# Altium schematic sheet Sunfish_ECU_MotorFilter_RevA.SchDoc
size A3; _PRJ_TITLE: PROJECT TITLE; _SHT_TITLE: Sheet; _REV: A; PageSetup: Record=PageOptions|CenterHorizontal=True|CenterVertical=True|PrintScale=0.71|XCorrection=1.00|YCorrection=1.00|PrintKind=0|BorderSize=5000000|LeftOffset=0|BottomOffset=0|Orientation=2|PaperLength=1000|PaperWidth=1000|Scale=100|PaperSource=258|PrintQuality=600|MediaType=1|DitherType=10|PaperKind=A3 (297x420mm)|PrintScaleMode=1
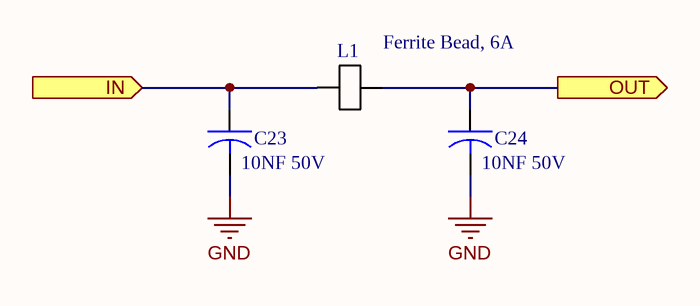
[diagram p0: Sunfish_ECU_MotorFilter_RevA.SchDoc]

## Parts
C23  10NF 50V  [0603]
C24  10NF 50V  [0603]
L1  Ferrite Bead, 6A  [1806]

## Ports
IN (in), OUT (out)

## Nets
GND: C23.2 C24.2
IN: C23.1 L1.1 ; port IN
OUT: C24.1 L1.2 ; port OUT

## Notes on the sheet
- TEMPLATE MODIFIED 09/04/16
- PCBA REV
- DATE
- ECO
- DESCRIPTION
- DRAWN
- APPROVED
- FILE NAME
- PCB REVISION
- Sheet NAME
- SCALE
- SHEET
- NTS
- SHEET SIZE
- A3

## Library data of the parts
C23 C24 = CAP_10NF_50V_10%_0603: CAP CER 10NF 50V 10% X7R 0603; Manufacturer: Murata; Manufacturer P/N: GRM188R71H103KA01D
L1 = IND_FERRITE_ BLM41PG600SN1L: Manufacturer: MURATA; Manufacturer P/N: BLM41PG600SN1L